# Altium project DC_motor_driver.PrjPcb
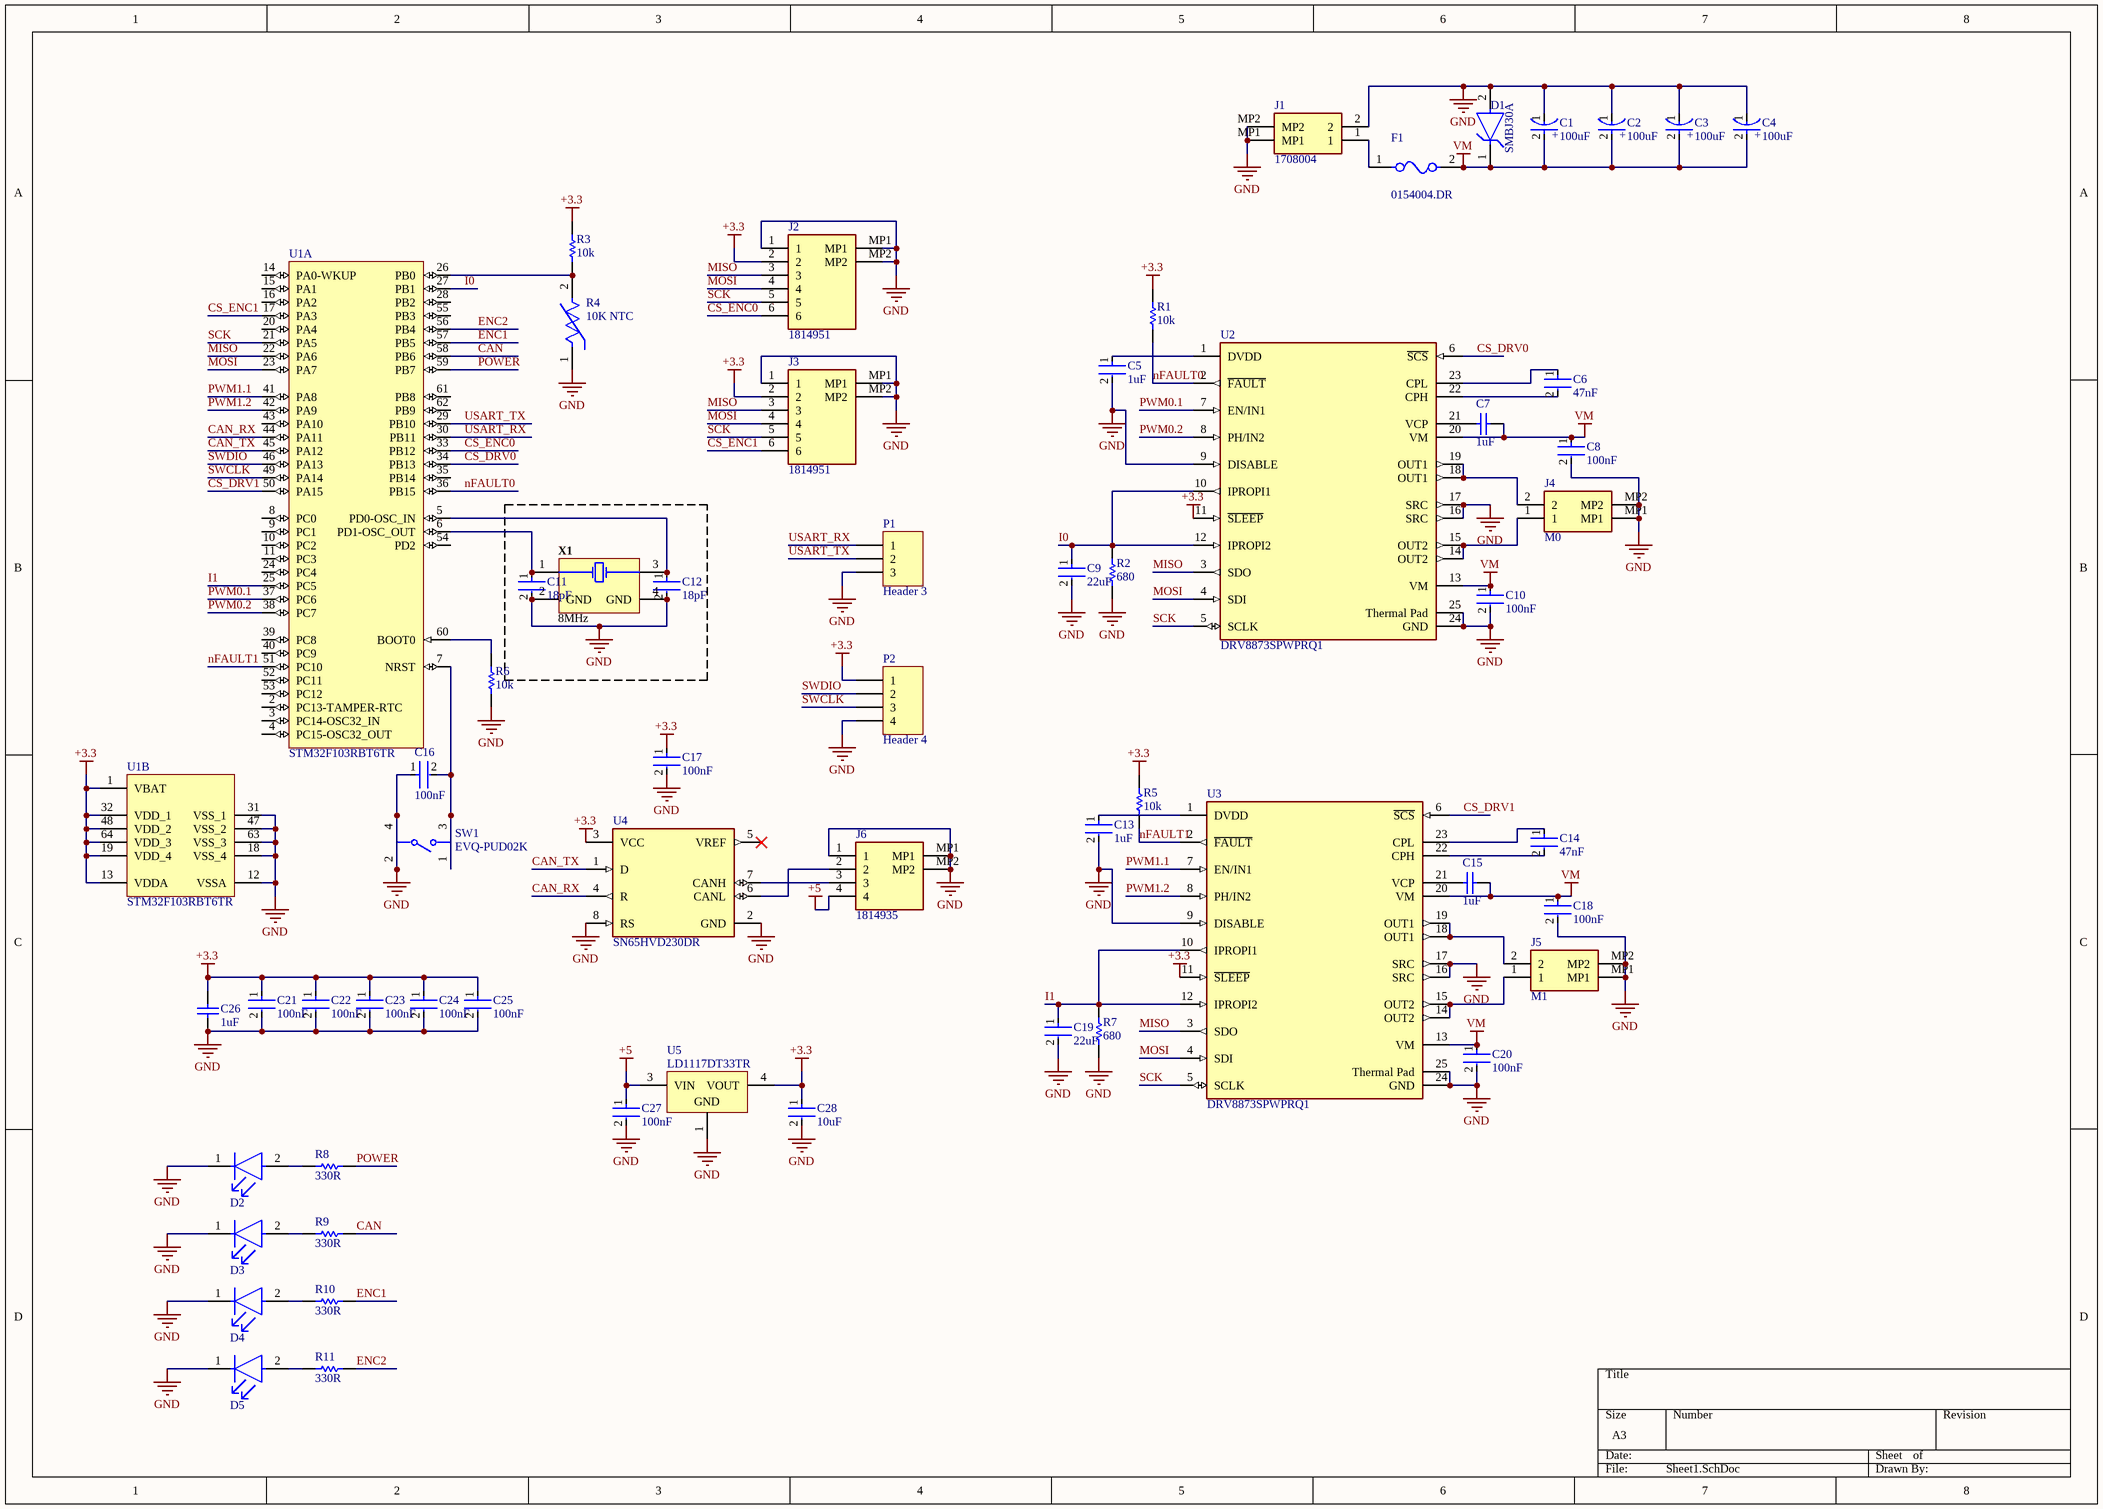
[diagram p0: Sheet1.SchDoc]
1 sheet, 60 parts. Net scope: global (net labels, ports and power ports of the same name join across sheets).
Board file: PCB1.PcbDoc

## Sheet Sheet1.SchDoc
size A3; Author: MG; CompanyName: SKAR; DrawnBy: MG; Revision: 1; SheetNumber: 1; SheetTotal: 1

### Parts
C1  100uF  [FP-FTD-MFG]
C2  100uF  [FP-FTD-MFG]
C3  100uF  [FP-FTD-MFG]
C4  100uF  [FP-FTD-MFG]
C5  1uF  [FP-0805-L_2_01_0_2-W_1_25-IPC_B]
C6  47nF  [FP-C0805C-DN-IPC_A]
C7  1uF  [CAPC2013X145X50ML20T25]
C8  100nF  [FP-0805-L_2_01_0_2-W_1_25-MFG]
C9  22uF  [FP-0805-L_2_01_0_2-W_1_25-IPC_B]
C10  100nF  [FP-0805-L_2_01_0_2-W_1_25-MFG]
C11  18pF  [FP-C0603C-CF-MFG]
C12  18pF  [FP-C0603C-CF-MFG]
C13  1uF  [FP-0805-L_2_01_0_2-W_1_25-IPC_B]
C14  47nF  [FP-C0805C-DN-IPC_A]
C15  1uF  [CAPC2013X145X50ML20T25]
C16  100nF  [FP-0805-L_2_01_0_2-W_1_25-IPC_B]
C17  100nF  [FP-0805-L_2_01_0_2-W_1_25-MFG]
C18  100nF  [FP-0805-L_2_01_0_2-W_1_25-MFG]
C19  22uF  [FP-0805-L_2_01_0_2-W_1_25-IPC_B]
C20  100nF  [FP-0805-L_2_01_0_2-W_1_25-MFG]
C21  100nF  [FP-0805-L_2_01_0_2-W_1_25-IPC_B]
C22  100nF  [FP-0805-L_2_01_0_2-W_1_25-IPC_B]
C23  100nF  [FP-0805-L_2_01_0_2-W_1_25-IPC_B]
C24  100nF  [FP-0805-L_2_01_0_2-W_1_25-IPC_B]
C25  100nF  [FP-0805-L_2_01_0_2-W_1_25-IPC_B]
C26  1uF  [CAPC2013X145X50ML20T25]
C27  100nF  [FP-0805-L_2_01_0_2-W_1_25-IPC_B]
C28  10uF  [FP-C0805C-DG-IPC_B]
D1  SMBJ30A  [FP-SMBJ30A-E3-52-0]
D2  TLLG4401  [FP-6_544-5255_01-4-MFG]  (value not drawn)
D3  TLLG4401  [FP-6_544-5255_01-4-MFG]  (value not drawn)
D4  TLLG4401  [FP-6_544-5255_01-4-MFG]  (value not drawn)
D5  TLLG4401  [FP-6_544-5255_01-4-MFG]  (value not drawn)
F1  0154004.DR  [FP-0154-MFG]
J1  1708004  [1708004]
J2  1814951  [1814951]
J3  1814951  [1814951]
J4  M0  [1815125]
J5  M1  [1815125]
J6  1814935  [1814935]
P1  Header 3  [HDR1X3]
P2  Header 4  [HDR1X4]
R1  10k  [RESC2013X60X35NL10T20]
R2  680  [RESC2013X60X35NL10T20]
R3  10k  [RESC2013X60X35ML10T20]
R4  10K NTC  [FP-NCP18-0_15-IPC_A]
R5  10k  [RESC2013X60X35NL10T20]
R6  10k  [RESC2013X60X35ML10T20]
R7  680  [RESC2013X60X35NL10T20]
R8  330R  [RESC2013X60X35ML10T20]
R9  330R  [RESC2013X60X35ML10T20]
R10  330R  [RESC2013X60X35ML10T20]
R11  330R  [RESC2013X60X35ML10T20]
SW1  EVQ-PUD02K  [FP-EVQ-PUD02K-MFG]
U1  STM32F103RBT6TR  [STM-LQFP64_V]  (parts A,B of 2)
U2  DRV8873SPWPRQ1  [FP-PWP0024J-MFG]
U3  DRV8873SPWPRQ1  [FP-PWP0024J-MFG]
U4  SN65HVD230DR  [FP-D0008A-IPC_A]
U5  LD1117DT33TR  [TO-252_M]
X1  8MHz  [TXC-7B-4_V]

### Nets
+3.3: C17.1 C21.1 C22.1 C23.1 C24.1 C25.1 C26.2 C28.1 J2.2 J3.2 P2.1 R1.2 R3.2 R5.2 U1.1(VBAT) U1.13(VDDA) U1.19(VDD_4) U1.32(VDD_1) U1.48(VDD_2) U1.64(VDD_3) U2.11(~{SLEEP}) U3.11(~{SLEEP}) U4.3(VCC) U5.4(VOUT)
+5: C27.1 J6.4 U5.3(VIN)
GND: C1.1(C) C2.1(C) C3.1(C) C4.1(C) C5.2 C8.2 C9.2 C10.2 C11.2 C12.2 C13.2 C16.1 C17.2 C18.2 C19.2 C20.2 C21.2 C22.2 C23.2 C24.2 C25.2 C26.1 C27.2 C28.2 D1.2(A) D2.1(C) D3.1(C) D4.1(C) D5.1(C) J1.2 J1.MP1 J1.MP2 J2.1 J2.MP1 J2.MP2 J3.1 J3.MP1 J3.MP2 J4.MP1 J4.MP2 J5.MP1 J5.MP2 J6.1 J6.MP1 J6.MP2 P1.3 P2.4 R2.1 R4.1 R6.1 R7.1 SW1.2 SW1.4 U1.12(VSSA) U1.18(VSS_4) U1.31(VSS_1) U1.47(VSS_2) U1.63(VSS_3) U2.9(DISABLE) U2.16(SRC) U2.17(SRC) U2.24(GND) U2.25(Thermal_Pad) U3.9(DISABLE) U3.16(SRC) U3.17(SRC) U3.24(GND) U3.25(Thermal_Pad) U4.2(GND) U4.8(RS) U5.1(GND) X1.2(GND) X1.4(GND)
VM: C1.2(A) C2.2(A) C3.2(A) C4.2(A) C7.2 C8.1 C10.1 C15.2 C18.1 C20.1 D1.1(C) F1.2 U2.13(VM) U2.20(VM) U3.13(VM) U3.20(VM)
CAN: R9.1 U1.58(PB6)
CAN_RX: U1.44(PA11) U4.4(R)
CAN_TX: U1.45(PA12) U4.1(D)
CS_DRV0: U1.34(PB13) U2.6(~{SCS})
CS_DRV1: U1.50(PA15) U3.6(~{SCS})
CS_ENC0: J2.6 U1.33(PB12)
CS_ENC1: J3.6 U1.17(PA3)
ENC1: R10.1 U1.57(PB5)
ENC2: R11.1 U1.56(PB4)
I0: C9.1 R2.2 U1.27(PB1) U2.10(IPROPI1) U2.12(IPROPI2)
I1: C19.1 R7.2 U1.25(PC5) U3.10(IPROPI1) U3.12(IPROPI2)
MISO: J2.3 J3.3 U1.22(PA6) U2.3(SDO) U3.3(SDO)
MOSI: J2.4 J3.4 U1.23(PA7) U2.4(SDI) U3.4(SDI)
nFAULT0: R1.1 U1.36(PB15) U2.2(~{FAULT})
nFAULT1: R5.1 U1.51(PC10) U3.2(~{FAULT})
POWER: R8.1 U1.59(PB7)
PWM0.1: U1.37(PC6) U2.7(EN/IN1)
PWM0.2: U1.38(PC7) U2.8(PH/IN2)
PWM1.1: U1.41(PA8) U3.7(EN/IN1)
PWM1.2: U1.42(PA9) U3.8(PH/IN2)
SCK: J2.5 J3.5 U1.21(PA5) U2.5(SCLK) U3.5(SCLK)
SWCLK: P2.3 U1.49(PA14)
SWDIO: P2.2 U1.46(PA13)
USART_RX: P1.1 U1.30(PB11)
USART_TX: P1.2 U1.29(PB10)
NetC5_1: C5.1 U2.1(DVDD)
NetC6_1: C6.1 U2.23(CPL)
NetC6_2: C6.2 U2.22(CPH)
NetC7_1: C7.1 U2.21(VCP)
NetC11_1: C11.1 U1.6(PD1-OSC_OUT) X1.1(X1)
NetC12_1: C12.1 U1.5(PD0-OSC_IN) X1.3(X2)
NetC13_1: C13.1 U3.1(DVDD)
NetC14_1: C14.1 U3.23(CPL)
NetC14_2: C14.2 U3.22(CPH)
NetC15_1: C15.1 U3.21(VCP)
NetC16_2: C16.2 SW1.1 SW1.3 U1.7(NRST)
NetD2_2: D2.2(A) R8.2
NetD3_2: D3.2(A) R9.2
NetD4_2: D4.2(A) R10.2
NetD5_2: D5.2(A) R11.2
NetF1_1: F1.1 J1.1
NetJ4_1: J4.1 U2.14(OUT2) U2.15(OUT2)
NetJ4_2: J4.2 U2.18(OUT1) U2.19(OUT1)
NetJ5_1: J5.1 U3.14(OUT2) U3.15(OUT2)
NetJ5_2: J5.2 U3.18(OUT1) U3.19(OUT1)
NetJ6_2: J6.2 U4.6(CANL)
NetJ6_3: J6.3 U4.7(CANH)
NetR3_1: R3.1 R4.2 U1.26(PB0)
NetR6_2: R6.2 U1.60(BOOT0)

Not connected (* = marked no-connect by the designer): U1 2(PC13-TAMPER-RTC) 3(PC14-OSC32_IN) 4(PC15-OSC32_OUT) 8(PC0) 9(PC1) 10(PC2) 11(PC3) 14(PA0-WKUP) 15(PA1) 16(PA2) 20(PA4) 24(PC4) 28(PB2) 35(PB14) 39(PC8) 40(PC9) 43(PA10) 52(PC11) 53(PC12) 54(PD2) 55(PB3) 61(PB8) 62(PB9); U4 5(VREF)*

### Notes on the sheet
- (in symbol CMP-05427-000027-1) +

### Library data of the parts
C1-C4 = CMP-05427-000027-1: CAP ALUM 100UF 20% 35V SMD; Ripple Current: 300mA; Polarity: Polar; Life (Hours): 2000Hour; Lead Diameter: 0.65mm; ESR (Equivalent Series Resistance): 260mR; Leakage Current: 35uA; REACH SVHC: No SVHC; Series: FT; Min Operating Temperature: -55°C; Diameter: 6.3mm; Max Operating Temperature: 105°C; Number of Pins: 2; Package Quantity: 1000; Length: 5.8mm; Lead Pitch: 1.8mm; Voltage: 35V; Construction: Cylindrical; Capacitance: 100uF; Height: 5.8mm; Tolerance: 20%; RoHS Compliant: Yes; Packaging: Tape and Reel; Ripple Current (AC): 300mA; Height - Seated (Max): 0.24inch; Voltage Rating: 35V; Radiation Hardening: No; Contact Plating: Tin; Termination: SMD/SMT; Voltage Rating (DC): 35V; Case/Package: Radial; Mount: Surface Mount
C5 C8-C10 C13 C16-C25 C27 = CMP-2007-04174-2: General Purpose Ceramic Capacitor, 0805, 100nF, 10%, X7R, 15%, 100V; Packaging: Tape and Reel; Min Operating Temperature: -55°C; Dielectric Material: Ceramic; Height: 1.4mm; Voltage Rating: 100V; Termination: SMD/SMT; Case Code (Imperial): 0805; Case Code (Metric): 2012; Case/Package: 0805; Construction: Flat; Radiation Hardening: No; Series: -; Dielectric: X7R; Package Quantity: 2000; Mount: Surface Mount; Capacitance: 100nF; Contact Plating: Tin; Voltage: 100V; Lead Free: Lead Free; Depth: 1.25mm; RoHS Compliant: Yes; Number of Pins: 2; Max Operating Temperature: 125°C; Length: 2.01mm; Voltage Rating (DC): 100V; Thickness: 0.055inch; REACH SVHC: No SVHC; Width: 0.049inch; Tolerance: 10%
C6 C14 = CMP-2007-01098-2: CAP CER 0.047UF 50V X7R 0805; Manufacturer Part Number: C0805C473K5RACTU; Manufacturer: KEMET; Value: 47,000 pF; Material: Ceramic; Tolerance: 0.1; Temperature Coefficient: 30ppm/°C; Ipc Land Pattern Name: CAPC200125X78; ComponentLink2URL: https://content.kemet.com/datasheets/KEM_C1003_C0G_SMD.pdf; ComponentLink2Description: Datasheet; Voltage Rating: 50 V; Device Class L3: Ceramic Capacitors; Temperature Range High: +125°C; Temperature: -55°C to +125°C; RoHS: TRUE; Capacitance: 47,000 pF; Digikey Description: CAP CER 0.047UF 50V X7R 0805; Octopart: https://octopart.com/c0805c473k5ractu-kemet-138387; Temperature Range Low: -55°C; Height: 0.88mm; Lead Free: Yes; Temperature Characteristic: X7R; Mouser Description: Capacitor; Ceramic; Cap 0.047 uF; Tol 10%; Vol-Rtg 50 VDC; SMT; 0805; X7R; Tape&Reel; Automotive: No; Device Class L1: Passive Components; Device Class L2: Capacitors; Package: C0805C-DN; Category: Cap
C7 C15 C26 = CMP-1036-04746-2: Manufacturer: Kemet; Part Number: C0805C105K4PACTU
C11 C12 = CMP-2006-03103-2: CAP CER 18PF 100V 5% NP0 0603; Manufacturer: KEMET; Manufacturer Part Number: C0603C180J1GACTU; Automotive Grade: Grade 1; Temperature Characteristic: C0G; Material: Ceramic; Tolerance: 0.05; Temperature Coefficient: 30ppm/°C; Temperature Range High: +125°C; RoHS: TRUE; Lead Free: Yes; Device Class L1: Passive Components; Mouser Description: Multilayer Ceramic Capacitors MLCC - SMD/SMT 100volts 18pF C0G 5%; Automotive: Yes; Category: Cap; Temperature Range Low: -55°C; Package: C0603C-CF; Digikey Description: CAP CER 18PF 100V 5% NP0 0603; Voltage Rating: 100 V; Value: 18 pF; Device Class L3: Ceramic Capacitors; Temperature: -55°C to +125°C; Capacitance: 18 pF; Octopart: https://octopart.com/c0603c180j1gactu-kemet-9138579; Height: 0.87mm; ComponentLink2URL: https://api.kemet.com/component-edge/download/datasheet/C0603C100J5GACAUTO.pdf; ComponentLink2Description: Datasheet; Device Class L2: Capacitors
C28 = CMP-2007-03243-2: CAP CER 10UF 10V X5R 0805; Manufacturer Part Number: C0805C106K8PACTU; Manufacturer: Kemet; 3DS Part Number: 220-00001; Tolerance: 10%; Temperature Coefficient: 15%; Material: Ceramic; Device Class L2: Capacitors; Device Class L1: Passive Components; ComponentLink2URL: https://content.kemet.com/datasheets/KEM_C1006_X5R_SMD.pdf; Height: 1.4mm; Lead Free: Yes; Digikey Description: CAP CER 10UF 10V X5R 0805; Octopart: https://octopart.com/c0805c106k8pactu-kemet-98697; Capacitance: 10uF; Value: 10uF; Temperature Range Low: -55°C; Temperature: -55°C to +85°C; Automotive: No; Mouser Description: CAP CER 10UF 10V X5R 0805; Ipc Land Pattern Name: CAPC200125X125; Temperature Range High: +85°C; Voltage: 10V; RoHS: TRUE; Device Class L3: Ceramic Capacitors; ComponentLink2Description: Datasheet; Voltage Rating: 10V; Package: C0805C-DG; Temperature Characteristic: X5R; Category: Cap
D1 = CMP-02577-000026-1: TVS DIODE 30VWM 48.4VC DO214AA; Polarity: Unidirectional; Clamping Voltage: 48.4V; Element Configuration: Single; Leakage Current: 1uA; Min Breakdown Voltage: 33.3V; Peak Pulse Power: 600W; Max Breakdown Voltage: 36.8V; Test Current: 1mA; Max Surge Current: 12.4A; Number of Unidirectional Channels: 1; Power Line Protection: No; Diode Type: ZENER; Operating Supply Voltage: 30V; Max Operating Temperature: 150°C; Number of Pins: 2; Series: TransZorb®; Min Operating Temperature: -55°C; Package Quantity: 750; Mount: Surface Mount; Resistor Type: Zener; Clamping Voltage-Max: 48.4V; Packaging: Tape and Reel; Length: 4.57mm; Direction: Unidirectional; Termination: SMD/SMT; Reverse Breakdown Voltage: 33.3V; Peak Pulse Current: 12.4A; Lead Free: Lead Free; Height: 2.24mm; RoHS Compliant: Yes; Breakdown Voltage: 36.8V; Max Power Dissipation: 600W; Power Dissipation: 600W; Max Reverse Leakage Current: 1uA; Reverse Standoff Voltage: 30V; Number of Channels: 1; Case/Package: DO-214AA; Width: 3.94mm; Number of Elements: 1; Radiation Hardening: No
D2-D5 = CMP-00030-39390728-1: TLLG4401 LED, Green, 2mcd, 3mmDia., T-1, +/-25deg, 565nm, 7mA, 1.9V Vf, 20V Vr, 20mW, -40; Test Current: 2mA; Wavelength: 575nm; Number of Elements: 1; Viewing Angle: 25°; Lens Transparency: Diffused; Voltage Rating (DC): 2.4V; Lead Length: 23mm; Max Junction Temperature (Tj): 100°C; Lens Style: Circular, Colored, Diffused, Dome, Round, Tinted; Reverse Voltage: 6V; Forward Voltage: 1.9V; Length: 3.2mm; Forward Current: 2mA; Color: Green; Dominant Wavelength: 575nm; Radiation Hardening: No; NexarPartId: 39390728; Lens Color: Green; REACH SVHC: Unknown; Lead Free: Lead Free; Number of Pins: 2; Luminous Intensity: 2mcd; Schedule B: 8541402000, 8541402000; Max Operating Temperature: 100°C; Illumination Color: Green; Mount: Through Hole; Packaging: Bulk; Depth: 3.2mm; Ambient Temperature Range High: 100°C; Case/Package: Radial; Power Dissipation: 20mW; Height: 4.5mm; RoHS: Compliant; Peak Wavelength: 565nm; Min Operating Temperature: -40°C; Number of LEDs: 1
F1 = CMP-08605-000003-1: FUSE BRD MNT 4A 125VAC/VDC 2SMD; Manufacturer: Littelfuse; Fuse Blow Speed: Fast; Max Fuse Ac Voltage: 125V; Lead Free: Yes; Device Class L3: unset; Manufacturer Part Number: 0154004.DR; Device Class L2: Fuses; Package: 0154; ComponentLink2Description: Datasheet; Temperature Range Low: -55°C; Temperature Range High: +125°C; Device Class L1: Circuit Protection; Height: 3.81mm; Temperature: -55°C to +125°C; Mouser Description: Surface Mount Fuses Fuseblock w/ fuse 4A OMNI BLOK 154; Automotive: No; Digikey Description: FUSE BRD MNT 4A 125VAC/VDC 2SMD; RoHS: TRUE; Category: Fuse; Fuse Current: 4A; Max Fuse Dc Voltage: 125V; ComponentLink2URL: https://www.littelfuse.com/~/media/electronics/datasheets/fuses/littelfuse_fuse_154_154t_154l_154tl_datasheet.pdf.pdf; Octopart: https://octopart.com/0154004.dr-littelfuse-565861
J1 = 1708004: Pluggable Terminal Blocks PTSM 0,5/ 2-HH- 2,5-SMD WH R32; Manufacturer_Name: Phoenix Contact; Geometry.Height: 5.1mm; Mouser Part Number: 651-1708004; Mouser Price/Stock: https://www.mouser.co.uk/ProductDetail/Phoenix-Contact/1708004?qs=lk7NfA15ZfaUlLrlGV0nCA%3D%3D; Manufacturer_Part_Number: 1708004; Datasheet Link: http://www.phoenixcontact.net/product/1708004
J2 J3 = 1814951: Pluggable Terminal Blocks PTSM 0,5/ 6-HH0-2,5- SMD WH R44
J4 J5 = 1815125: Phoenix Contact PTSM Series, 2.5mm Pitch Printed Circuit Board Connector, 6A; Geometry.Height: 5mm; Mouser Part Number: 651-1815125; Mouser Price/Stock: https://www.mouser.com/Search/Refine.aspx?Keyword=651-1815125; Manufacturer_Name: Phoenix Contact; Manufacturer_Part_Number: 1815125; Datasheet Link: https://www.phoenixcontact.com/online/portal/ca/?uri=pxc-oc-itemdetail:pid=1815125&library=caen&pcck=P-11-02-11&tab=1&selectedCategory=ALL
J6 = 1814935: Pluggable Terminal Blocks PTSM 0,5/ 4-HH0-2,5- SMD WH R32
P1 = Header 3: Header, 3-Pin; LatestRevisionDate: 17-Jul-2002; LatestRevisionNote: Re-released for DXP Platform.; Publisher: Altium Limited
P2 = Header 4: Header, 4-Pin; LatestRevisionDate: 17-Jul-2002; LatestRevisionNote: Re-released for DXP Platform.; Publisher: Altium Limited
R1 R2 R5 R7 = CMP-1659-00013-4: Chip Resistor, 10 KOhm, +/- 1%, 0.125 W, -55 to 155 degC, 0805 (2012 Metric), RoHS, Tape and Reel; Manufacturer: Yageo; Voltage Rating: 150 V; Mount: Surface Mount; ComponentLink1Description: Manufacturer URL; ComponentLink2URL: http://www.yageo.com/documents/recent/PYu-RC_Group_51_RoHS_L_04.pdf; Pins: 2; Length: 2 mm; Min Operating Temperature: -55 degC; Height: 0.5 mm; Mounting Technology: Surface Mount; RoHSCompliant: true; REACH SVHC: No SVHC; ComponentLink1URL: http://www.yageo.com/; Max Operating Temperature: 155 degC; PackageReference: 0805; DatasheetVersion: Rev. 4, 02/2016; Package Quantity: 5000; Packaging: Tape and Reel; ComponentLink2Description: Datasheet; PackageDescription: 2-Pin Surface Mounted Device, Body 2 x 1.25 mm
R3 R6 = CMP-2100-03673-1: Chip Resistor, 0 Ohm, Jumper, +/- 5%, 0.125 W, -55 to 155 degC, 0805 (2012 Metric), RoHS, Tape and Reel; Manufacturer: Yageo; Power Rating: 125mW; Resistance: 0mOhm; Voltage Rating (DC): 150V; Temperature Coefficient: 200ppm/degreesC; Height: 0.5mm; Depth: 1.25mm; Case Code (Imperial): 0805; Lead Free: LeadFree; Military Standard: Not; Package Description: 2-Pin Surface Mounted Device, Body 2 x 1.25 mm; Case Code (Metric): 2012; Composition: ThickFilm; Voltage Rating: 150V; Manufacturer URL: http://www.yageo.com/; Packaging: TapeandReel; Package Reference: 0805; REACH SVHC: Unknown; Tolerance: 5%; Case/Package: 0805; Max Operating Temperature: 155degC; Number of Pins: 2; Min Operating Temperature: -55degC; RoHSCompliant: true; Length: 2mm; Datasheet URL: http://www.yageo.com/NewPortal/yageodocoutput?fileName=/pdf/R-Chip/PYu-RC_Group_51_RoHS_L_5.pdf; Termination: SMD/SMT; Radiation Hardening: No; Width: 1.25mm; Contact Plating: Tin; Datasheet Version: Rev. 5, 10/2016
R4 = CMP-2000-05271-3: NTC Thermistor for Temperature Sensor, 0603, 10kΩ, 1%, 0.1mA, 5V; Manufacturer Series: NCP18; Accuracy: 0.7%; Current Rating: 310uA; Max Power Dissipation: 100mW; Thermistor Application: TEMPERATURE COMPENSATION; Number of Terminals/Pins: 2; Resistance: 10kR; Case Code (Metric): 1608; RoHS Compliant: Yes; Max Operating Temperature: 125°C; Resistance Tolerance: 1%; Case/Package: 0603; Mount: Surface Mount; Lead Free: Lead Free; Min Operating Temperature: -40°C; REACH SVHC: No SVHC; Package Shape: Rectangular; Radiation Hardening: No; Series: NCP; Depth: 0.8mm; Number of Pins: 2; Length: 1.6mm; Height: 0.8mm; Terminal Placement: Dual; Tolerance: 1%; Case Code (Imperial): 0603; Terminal Finish: Tin; Power Rating: 100mW; Termination: SMD/SMT; Packaging: Tape and Reel; Package Quantity: 1
R8-R11 = CMP-2100-03671-1: Chip Resistor, 1 KOhm, +/- 1%, 125 mW, -55 to 155 degC, 0805 (2012 Metric), RoHS, Tape and Reel; Manufacturer: Yageo; Temperature Coefficient: 100ppm/degreesC; Voltage Rating (DC): 150V; Max Power Dissipation: 125mW; Resistance: 1KOhm; Number of Pins: 2; Number of Terminations: 2; Datasheet URL: http://www.yageo.com/NewPortal/yageodocoutput?fileName=/pdf/R-Chip/PYu-RC_Group_51_RoHS_L_5.pdf; Length: 0.079inch; Package Description: 2-Pin Surface Mounted Device, Body 2 x 1.25 mm; Depth: 1.25mm; Height: 0.024inch; Military Standard: Not; Case/Package: 0805; Package Reference: 0805; RoHSCompliant: true; Lead Free: LeadFree; Packaging: TapeandReel; Package Quantity: 1; Datasheet Version: Rev. 5, 10/2016; Tolerance: 1%; Min Operating Temperature: -55degC; Voltage Rating: 150V; Composition: ThickFilm; Case Code (Imperial): 0805; Power Rating: 125mW; Width: 0.049inch; Case Code (Metric): 2012; Manufacturer URL: http://www.yageo.com/; Max Operating Temperature: 155degC; REACH SVHC: Unknown; Termination: SMD/SMT
SW1 = CMP-05618-000144-1: SWITCH TACTILE SPST-NO 0.05A 12V; Current Rating: 50mA; Operating Force: 2.2N; Contact Resistance: 500mR; Switch Travel: 0.3mm; Actuator Length: 1mm; Illumination Type: Non-Illuminated; Electrical Life: 100000Cycles; Actuator Color: Black; Switch Function: Off-Mom; Throw Configuration: SPST; Radiation Hardening: No; Min Operating Temperature: -20°C; Length: 4.7mm; Size: 3.5mm; Package Quantity: 1; RoHS Compliant: Yes; Width: 3.5mm; Max Operating Temperature: 70°C; Max Voltage Rating (DC): 12V; Max Current Rating: 50mA; Height: 1.65mm; Depth: 4.5mm; Voltage Rating (DC): 12V; Mount: Surface Mount; Lead Free: Lead Free; Termination: J-Bend; Series: EVQPU; Contact Current Rating: 50mA; Orientation: Right Angle; REACH SVHC: No SVHC; Packaging: Tape and Reel; Contact Plating: Gold; Mechanical Life: 100000Cycles
U1 = CMP-0237-00169-4: ARM Cortex-M3 32-bit MCU, 128 KB Flash, 20 KB Internal RAM, 51 I/Os, 64-pin LQFP, -40 to 85 degC, Tape and Reel; Operating Frequency(F) (Processor speed) (MHz): 72; Internal RAM Size (kB): 20; I/Os (High Current): 51; FLASH Size (Prog) (kB): 128; Supply Voltage(Vcc) min (V): 2; A/D Converter: 2x12-bit (16 Channel); ComponentLink3URL: http://www.st.com/st-web-ui/static/active/en/resource/technical/document/datasheet/DM00037051.pdf; ComponentLink2Description: Datasheet; PackageDescription: 64-Pin Low Profile Quad Flat Package, 10 x 10 mm Body, 0.5 mm Pitch; ComponentLink3Description: Package Specification; Mounting Technology: Surface Mount; ComponentLink1Description: Manufacturer URL; DatasheetVersion: Rev. 16; PackageReference: LQFP64; PartNumber: STM32F103RBT6TR; Core: ARM Cortex-M3; ComponentLink2URL: http://www.st.com/st-web-ui/static/active/en/resource/technical/document/datasheet/CD00161566.pdf; ComponentLink1URL: http://www.st.com/web/en/home.html; PackageVersion: Rev. 4, 06/2013; Packing: Tape and Reel
U2 U3 = CMP-04915-000063-1: IC MTRDRV UNIPLR 0-5.5V 24HTSSOP; Logic Function: AND GATE; Output Current: 10mA; Interface: SPI; RoHS Compliant: Yes; Min Operating Temperature: -40°C; Packaging: Cut Tape; Mount: Surface Mount; Max Operating Temperature: 125°C
U4 = CMP-0315-00015-3: IC TRANSCEIVER HALF 1/1 8SOIC; Number of Transceivers: 1; Operating Supply Voltage: 3.3V; Number of I/Os: 2; Max Supply Current: 17mA; Max Supply Voltage: 3.6V; Min Supply Voltage: 3V; Data Rate: 1Mbps; Min Operating Temperature: -40°C; Packaging: Tape and Reel; Lead Free: Lead Free; Number of Transmit Buffers: 1; Max Operating Temperature: 85°C; Number of Receive Buffers: 1; Number of Pins: 8; Package Quantity: 1; Radiation Hardening: No; Case/Package: D; REACH SVHC: No SVHC; Weight: 0.002561oz; Termination: SMD/SMT; Contact Plating: Gold; Nominal Supply Current: 17mA; Number of Receivers: 1; Number of Drivers: 1
U5 = CMP-0244-00088-1: Fixed Low Drop Positive Voltage Regulator, 3.3V, 3-Pin DPAK, Tape and Reel; ComponentLink1Description: Manufacturer URL; PackageVersion: 2011; PackageReference: TO-252; ComponentLink2Description: Datasheet; ComponentLink1URL: http://www.st.com; DatasheetVersion: 1/11/2011; PackageDescription: 3-Pin Transistor Outline Package 2.28 mm Pitch, 9.7 mm Lead Span (DPAK); ComponentLink2URL: http://www.st.com/internet/com/TECHNICAL_RESOURCES/TECHNICAL_LITERATURE/DATASHEET/CD00000544.pdf
X1 = CMP-1774-00004-1: SMD Seam Sealing Crystal, 8 MHz, +/- 30 ppm, 18 pF, -10 to 70 degC, 4-Pin SMD, RoHS, Tape and Reel; Power Rating: 100 mW; Case\Package: 0603; Voltage Rating: 50 V; Tolerance: 1%; Resistance: 150 Ohm; Package Quantity: 5000; Case Code (Metric): 1608; Packaging: Tape and Reel; Length: 1.6 mm; RoHSCompliant: true; REACH SVHC: No SVHC; Mount: Surface Mount; Case Code (Imperial): 0603; Pins: 2; Width: 0.8 mm; PackageDescription: 4-Pin Surface Mount Device, Body 5 x 3.2 mm, Pitch 3.7 mm; ComponentLink1Description: Datasheet; DatasheetVersion: Jul-15; ComponentLink1URL: http://www.txccorp.com/download/products/quartz_crystals/2015TXC_7B_19.pdf; PackageReference: 7B-4; Height: 0.45 mm; Max Operating Temperature: 155 degC; Min Operating Temperature: -55 degC; Voltage Rating (DC): 50 V